# EAGLE design NodeGeneric.v1.cg2 (EAGLE 4.11)
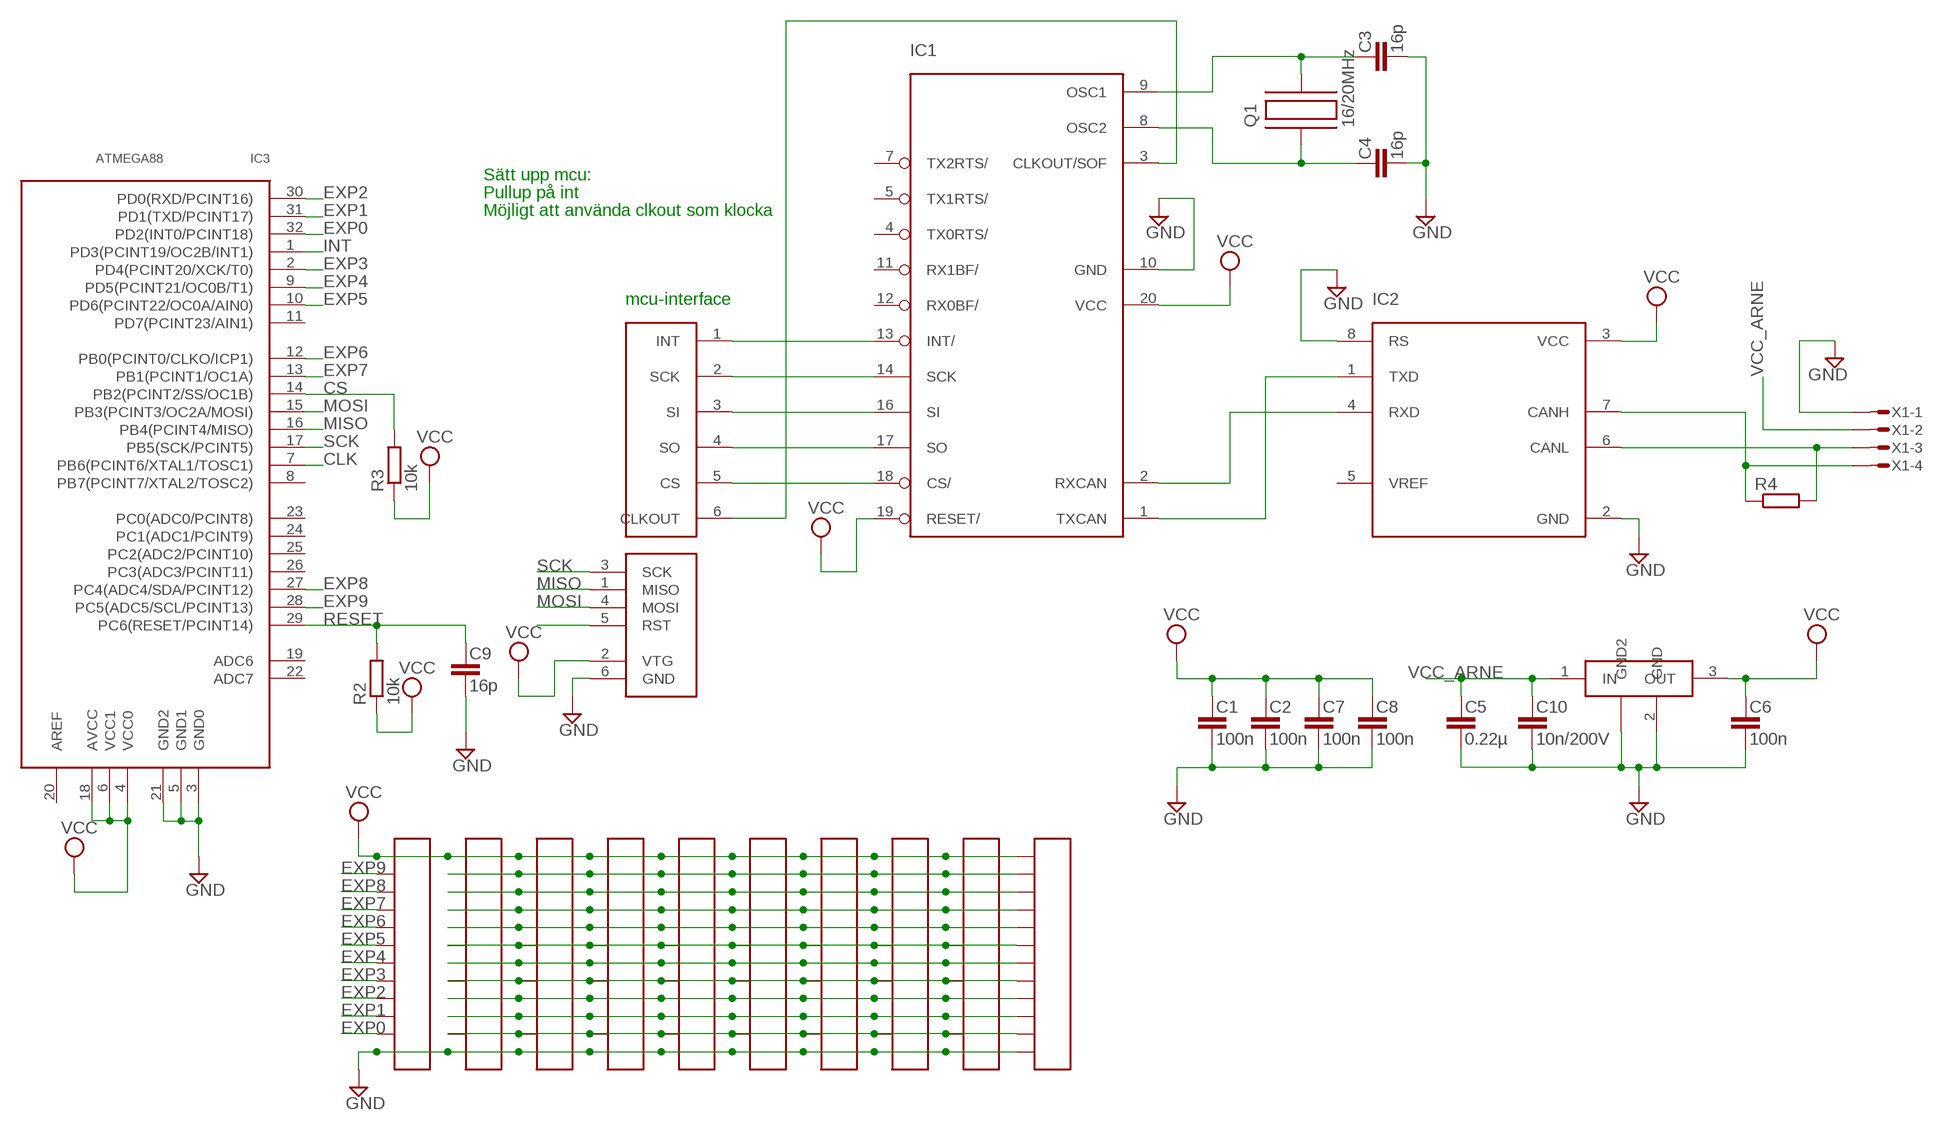
[diagram p0: schematic, sheet 1]

## Parts
C1  100n  C-EU  [C0603]
C2  100n  C-EU  [C0603]
C3  16p  C-EU  [C0603]
C4  16p  C-EU  [C0603]
C5  0.22µ  C-EU  [C0603]
C6  100n  C-EU  [C0603]
C7  100n  C-EU  [C0603]
C8  100n  C-EU  [C0603]
C9  16p  C-EU  [C0603]
C10  10n/200V  C-EU  [C0603]
IC1  MCP2515  [TSSOP]
IC2  MCP2551  [TSSOP]
IC3  ATMEGA88  [TQFP32]
IC4  LM340MP-5.0  [SOT223]
Q1  16/20MHz  C-MAC-LFA147E  [SMD]
R2  10k  R-EU_R0603  [R0603@1]
R3  10k  R-EUR0603  [R0603]
R4  R-EUR0603  [R0603]
U$1  CAN-INTERFACE  [VIA-LIST]
U$3  COLUMN  [COLUMN]
U$4  COLUMN  [COLUMN]
U$5  COLUMN  [COLUMN]
U$6  COLUMN  [COLUMN]
U$7  COLUMN  [COLUMN]
U$8  COLUMN  [COLUMN]
U$9  COLUMN  [COLUMN]
U$10  COLUMN  [COLUMN]
U$11  COLUMN  [COLUMN]
U$12  COLUMN  [COLUMN]
X1  MICROMATCH-4  [MICROMATCH-4-SMD]
X2  ISP  AVRISP6PIN  [6PIN]

## Nets
CANH: IC2.7(CANH) R4.1 X1.4
CLK: IC1.3(CLKOUT/SOF) IC3.7(PB6(PCINT6/XTAL1/TOSC1)) U$1.6(CLKOUT)
CS: IC1.18(CS/) IC3.14(PB2(PCINT2/SS/OC1B)) R3.2 U$1.5(CS)
EXP0: IC3.32(PD2(INT0/PCINT18)) U$3.11
EXP1: IC3.31(PD1(TXD/PCINT17)) U$3.10
EXP2: IC3.30(PD0(RXD/PCINT16)) U$3.9
EXP3: IC3.2(PD4(PCINT20/XCK/T0)) U$3.8
EXP4: IC3.9(PD5(PCINT21/OC0B/T1)) U$3.7
EXP5: IC3.10(PD6(PCINT22/OC0A/AIN0)) U$3.6
EXP6: IC3.12(PB0(PCINT0/CLKO/ICP1)) U$3.5
EXP7: IC3.13(PB1(PCINT1/OC1A)) U$3.4
EXP8: IC3.27(PC4(ADC4/SDA/PCINT12)) U$3.3
EXP9: IC3.28(PC5(ADC5/SCL/PCINT13)) U$3.2
EXP11: U$4.11 U$5.11 U$6.11 U$7.11 U$8.11 U$9.11 U$10.11 U$11.11 U$12.11
EXP12: U$4.10 U$5.10 U$6.10 U$7.10 U$8.10 U$9.10 U$10.10 U$11.10 U$12.10
EXP13: U$4.9 U$5.9 U$6.9 U$7.9 U$8.9 U$9.9 U$10.9 U$11.9 U$12.9
EXP14: U$4.8 U$5.8 U$6.8 U$7.8 U$8.8 U$9.8 U$10.8 U$11.8 U$12.8
EXP15: U$4.7 U$5.7 U$6.7 U$7.7 U$8.7 U$9.7 U$10.7 U$11.7 U$12.7
EXP16: U$4.6 U$5.6 U$6.6 U$7.6 U$8.6 U$9.6 U$10.6 U$11.6 U$12.6
EXP17: U$4.5 U$5.5 U$6.5 U$7.5 U$8.5 U$9.5 U$10.5 U$11.5 U$12.5
EXP18: U$4.4 U$5.4 U$6.4 U$7.4 U$8.4 U$9.4 U$10.4 U$11.4 U$12.4
EXP19: U$4.3 U$5.3 U$6.3 U$7.3 U$8.3 U$9.3 U$10.3 U$11.3 U$12.3
EXP20: U$4.2 U$5.2 U$6.2 U$7.2 U$8.2 U$9.2 U$10.2 U$11.2 U$12.2
GND: C1.2 C2.2 C3.2 C4.2 C5.2 C6.2 C7.2 C8.2 C9.2 C10.2 IC1.10(GND) IC2.2(GND) IC2.8(RS) IC3.3(GND0) IC3.5(GND1) IC3.21(GND2) IC4.2(GND) IC4.4(GND2) U$3.12 U$4.12 U$5.12 U$6.12 U$7.12 U$8.12 U$9.12 U$10.12 U$11.12 U$12.12 X1.1 X2.6(GND)
INT: IC1.13(INT/) IC3.1(PD3(PCINT19/OC2B/INT1)) U$1.1(INT)
MISO: IC1.17(SO) IC3.16(PB4(PCINT4/MISO)) U$1.4(SO) X2.1(MISO)
MOSI: IC1.16(SI) IC3.15(PB3(PCINT3/OC2A/MOSI)) U$1.3(SI) X2.4(MOSI)
N$1: IC1.2(RXCAN) IC2.4(RXD)
N$2: IC1.1(TXCAN) IC2.1(TXD)
N$5: IC2.6(CANL) R4.2 X1.3
N$12: C3.1 IC1.9(OSC1) Q1.P$2
N$13: C4.1 IC1.8(OSC2) Q1.P$1
RESET: C9.1 IC3.29(PC6(RESET/PCINT14)) R2.2 X2.5(RST)
SCK: IC1.14(SCK) IC3.17(PB5(SCK/PCINT5)) U$1.2(SCK) X2.3(SCK)
VCC: C1.1 C2.1 C6.1 C7.1 C8.1 IC1.19(RESET/) IC1.20(VCC) IC2.3(VCC) IC3.4(VCC0) IC3.6(VCC1) IC3.18(AVCC) IC4.3(OUT) R2.1 R3.1 U$3.1 U$4.1 U$5.1 U$6.1 U$7.1 U$8.1 U$9.1 U$10.1 U$11.1 U$12.1 X2.2(VTG)
VCC_ARNE: C5.1 C10.1 IC4.1(IN) X1.2
Unconnected: IC1.4(TX0RTS/) IC1.5(TX1RTS/) IC1.7(TX2RTS/) IC1.11(RX1BF/) IC1.12(RX0BF/) IC2.5(VREF) IC3.8(PB7(PCINT7/XTAL2/TOSC2)) IC3.11(PD7(PCINT23/AIN1)) IC3.19(ADC6) IC3.20(AREF) IC3.22(ADC7) IC3.23(PC0(ADC0/PCINT8)) IC3.24(PC1(ADC1/PCINT9)) IC3.25(PC2(ADC2/PCINT10)) IC3.26(PC3(ADC3/PCINT11))

## Notes on the sheet
- Sätt upp mcu:
- Pullup på int
- Möjligt att använda clkout som klocka
- mcu-interface

## Library data of the parts
C1-C10 = rcl:C-EU
IC1 = mcp2515:MCP2515
IC2 = mcp2551:MCP2551
IC3 = atmega88:ATMEGA88
IC4 = lm340mp:LM340MP-5.0
Q1 = hc49-4h-smx:C-MAC-LFA147E
R2 = rcl:R-EU_: RESISTOR, European symbol
R3 R4 = rcl:R-EU
U$1 = can-interface:CAN-INTERFACE
U$3-U$12 = expboard:COLUMN
X1 = micromatch-smd:MICROMATCH-4: MicroMaTch 4 7-215464-4 / 0-215464-4 Drawing Number C-215464 DDEController.pdf
X2 = avrisp:AVRISP6PIN

## Board
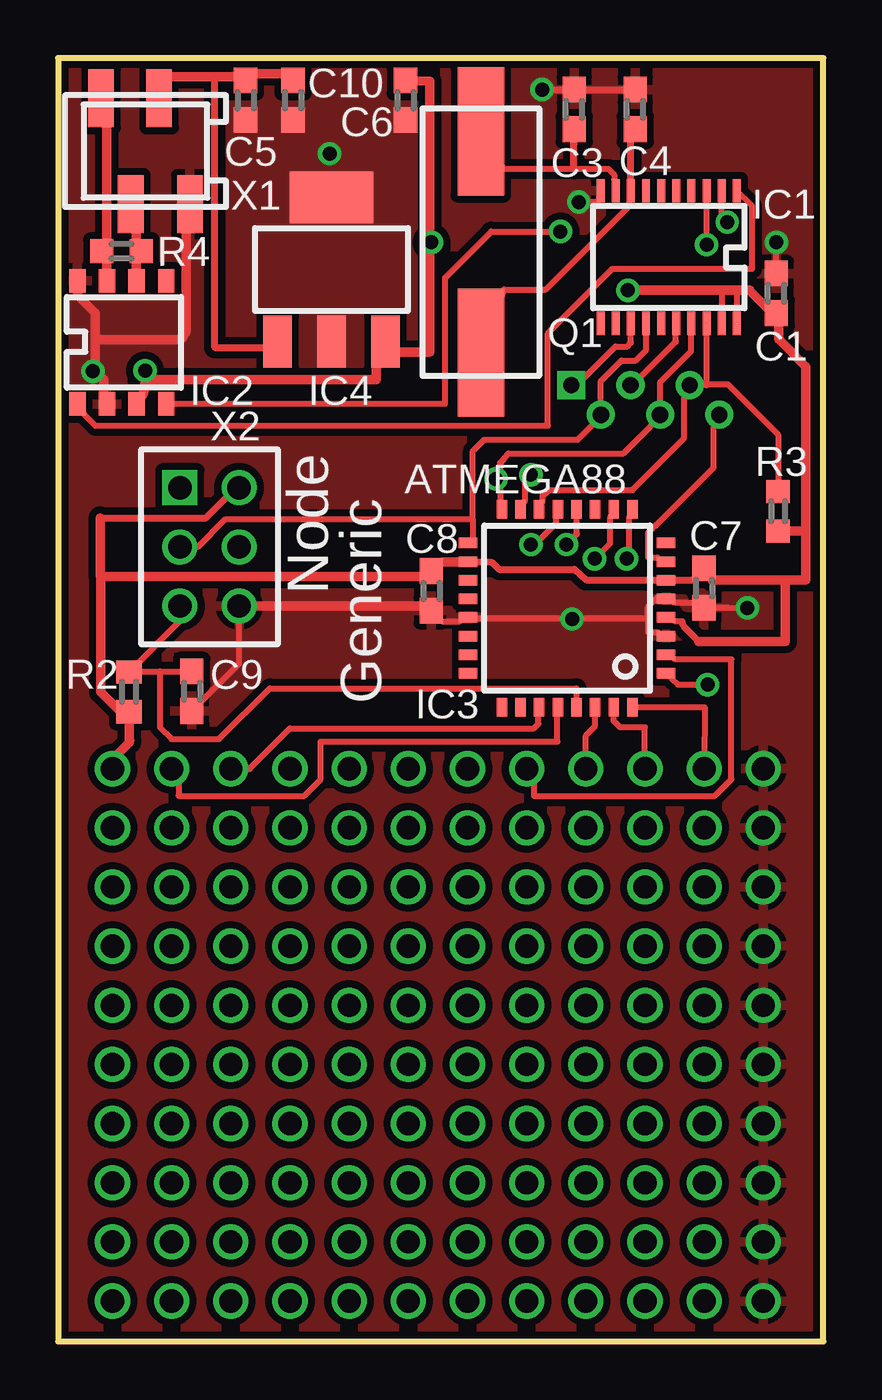
[diagram p1: board, top side]
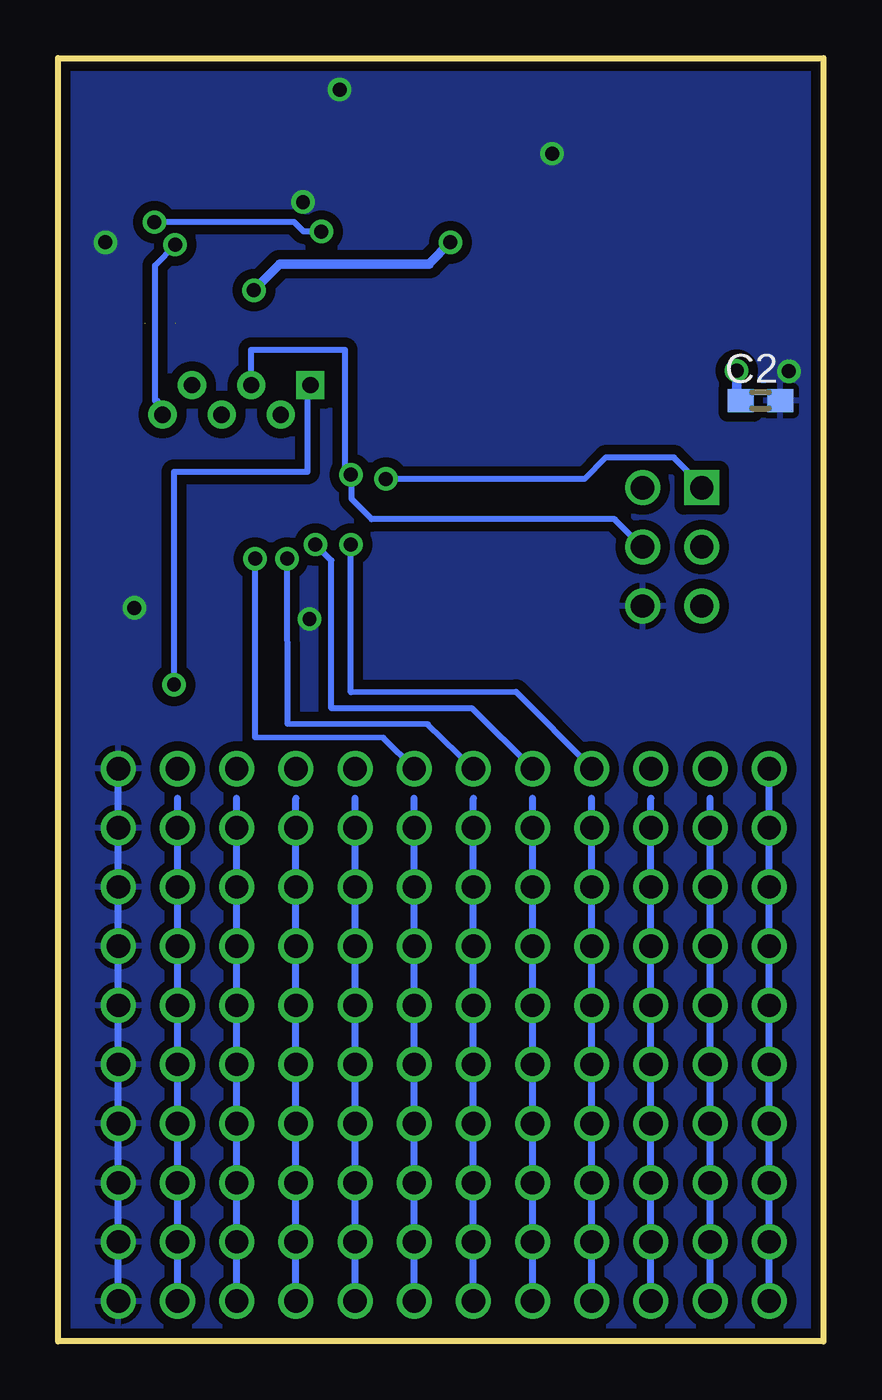
[diagram p2: board, bottom side, seen from below]

Size 32.85 x 55.1 mm. Coordinates in mm from the lower left corner, seen from the top.
Outline: 0,0 32.85,0 32.85,55.1 0,55.1 0,0
Copper layers (1*16): Top 0.035mm / dielectric 1.5mm / Bottom 0.035mm
Design rules "10mils, 0.6drill": minimum track width 10mil, minimum drill 0.6mm, track to track 10mil, track to pad 10mil, pad to pad 10mil, via to via 10mil, smd to smd 10mil, copper to edge 10mil, drill to drill 10mil, minimum pad ring 10mil, minimum via ring 8mil, stop-mask expansion 0mil, vias tented up to drill 0mil, thermal gap 10mil

### Footprints (pad centres in the part's own frame; a part is rotated, then mirrored left to right if it is on the bottom)
C0603 = smd 1.1 x 1: 1 -0.85,0; 2 0.85,0
TSSOP = smd 0.34 x 1: 1 -2.925,-2.85; 2 -2.275,-2.85; 3 -1.625,-2.85; 4 -0.975,-2.85; 5 -0.325,-2.85; 6 0.325,-2.85; 7 0.975,-2.85; 8 1.625,-2.85; 9 2.275,-2.85; 10 2.925,-2.85; 11 2.925,2.85; 12 2.275,2.85; 13 1.625,2.85; 14 0.975,2.85; 15 0.325,2.85; 16 -0.325,2.85; 17 -0.975,2.85; 18 -1.625,2.85; 19 -2.275,2.85; 20 -2.925,2.85
TSSOP' = smd 0.7 x 1: 1 -1.981,-2.645; 2 -0.711,-2.645; 3 0.559,-2.645; 4 1.829,-2.645; 5 1.829,2.645; 6 0.559,2.645; 7 -0.711,2.645; 8 -1.981,2.645
TQFP32 = smd 0.8 x 0.45: 1 -4.25,2.65; 2 -4.25,1.85; 3 -4.25,1.05; 4 -4.25,0.25; 5 -4.25,-0.55; 6 -4.25,-1.35; 7 -4.25,-2.15; 8 -4.25,-2.95; 17 4.25,-2.95; 18 4.25,-2.15; 19 4.25,-1.35; 20 4.25,-0.55; 21 4.25,0.25; 22 4.25,1.05; 23 4.25,1.85; 24 4.25,2.65 | smd 0.45 x 0.8: 9 -2.8,-4.4; 10 -2,-4.4; 11 -1.2,-4.4; 12 -0.4,-4.4; 13 0.4,-4.4; 14 1.2,-4.4; 15 2,-4.4; 16 2.8,-4.4; 25 2.8,4.1; 26 2,4.1; 27 1.2,4.1; 28 0.4,4.1; 29 -0.4,4.1; 30 -1.2,4.1; 31 -2,4.1; 32 -2.8,4.1
SOT223 = smd 1.219 x 2.235: 1 -2.311,-3.099; 2 0,-3.099; 3 2.311,-3.099 | smd 3.6 x 2.2: 4 0,3.099
SMD = smd 5.5 x 2: P$1 4.75,0; P$2 -4.75,0
R0603@1 = smd 1 x 1.1: 1 -0.85,0; 2 0.85,0
R0603 = smd 0.991 x 1.016: 1 -0.85,0; 2 0.85,0
VIA-LIST = drill 0.7 square: 1 0,2.54 | drill 0.7 round: 2 -1.27,1.27; 3 0,0; 4 -1.27,-1.27; 5 0,-2.54; 6 -1.27,-3.81
COLUMN = drill 1 round: 1 0,15.24; 2 0,12.7; 3 0,10.16; 4 0,7.62; 5 0,5.08; 6 0,2.54; 7 0,0; 8 0,-2.54; 9 0,-5.08; 10 0,-7.62; 11 0,-10.16; 12 0,-12.7
MICROMATCH-4-SMD = smd 1.1 x 2.5: 1 1.905,-2.272; 2 0.585,2.272; 3 -0.635,-2.272; 4 -1.905,2.272
6PIN = drill 1 square: 1 -1.27,2.54 | drill 1 round: 2 1.27,2.54; 3 -1.27,0; 4 1.27,0; 5 -1.27,-2.54; 6 1.27,-2.54

### Placement (x,y rotation side)
C1  30.82,45 90 top
C2  2.7,40.4 0 bottom
C3  22.15,52.9 90 top
C4  24.77,52.9 90 top
C5  8.04,53.29 270 top
C6  14.9,53.29 270 top
C7  27.72,32.35 270 top
C8  16.02,32.22 270 top
C9  5.73,27.92 270 top
C10  10.07,53.29 270 top
IC1  26.21,46.56 180 top
IC2  MCP2551  [TSSOP']  2.8,42.9 0 top
IC3  21.85,31.33 180 top
IC4  11.73,46.02 0 top
Q1  18.14,47.2 270 top
R2  3.04,27.89 90 top
R3  30.9,35.64 90 top
R4  2.71,46.81 0 top
U$1  24.57,41.06 90 top
U$3  17.57,24.59 90 top
U$4  17.57,1.73 90 top
U$5  17.57,4.27 90 top
U$6  17.57,6.81 90 top
U$7  17.57,9.35 90 top
U$8  17.57,11.89 90 top
U$9  17.57,14.43 90 top
U$10  17.57,16.97 90 top
U$11  17.57,19.51 90 top
U$12  17.57,22.05 90 top
X1  3.75,51.1 0 top
X2  6.49,34.11 0 top

### Tracks (layer width: path | path; a pad name or v marks a point on that pad's centre or on a via)
CANH
  Top 0.254: R4.1 2.07,46.81 2.07,46.69 2.07,45.54 IC2.7
  Top 0.406: X1.4 2.07,52.76 2.07,46.69 2.07,45.56 IC2.7
CLK  (via drill 0.6)
  Top 0.254: v27.83,47.09 27.83,48.92 IC1.3 | U$1.6 28.13,39.22 28.13,37.52 25.67,35.05 25.67,35.03 25.57,35 25.49,34.93 25.52,34.93 25.31,34.72 25.31,33.66 25.72,33.66 25.9,33.48 IC3.7
  Bottom 0.254: v27.83,47.09 28.69,46.2 28.69,40.39 28.59,40.39 U$1.6
CS  (1 unrouted)
  Top 0.254: 27.83,41.1 27.83,41.06 | 27.83,41.1 IC1.18 | 24.7,36.63 24.65,36.58 | 24.7,36.63 26.86,38.79 26.86,40.74 27.11,40.98 U$1.5 27.09,41.06 27.09,41.1 27.83,41.1 | IC3.14 20.79,36.09 20.79,36.3 21.05,36.55 24.65,36.55 24.7,36.63 | R3.2 30.9,38.94 28.74,41.1 27.83,41.1
EXP0
  Top 0.254: U$3.11 27.73,24.72 27.75,27.23 IC3.32
EXP1
  Top 0.254: IC3.31 23.85,26.64 24.12,26.37 25.19,26.37 U$3.10
EXP2
  Top 0.254: IC3.30 23.05,26.43 22.65,26.01 U$3.9
EXP3
  Top 0.254: IC3.2 26.48,29.29 28.9,29.29 28.9,24.13 28.18,23.42 20.41,23.42 20.41,23.88 U$3.8
EXP4  (via drill 0.6)
  Top 0.254: v24.4,33.61 24.5,33.71 24.5,35.33 IC3.9
  Bottom 0.254: v24.4,33.61 24.4,25.93 18.89,25.91 U$3.7
EXP5  (via drill 0.6)
  Top 0.254: v23.03,33.61 23.69,34.27 23.69,35.33 IC3.10
  Bottom 0.254: v23.03,33.61 23,26.52 16.98,26.49 U$3.6
EXP6  (via drill 0.6)
  Top 0.254: IC3.12 22.27,35.71 22.27,34.67 v21.81,34.22
  Bottom 0.254: v21.81,34.22 21.12,33.53 21.12,27.18 15.08,27.18 U$3.5
EXP7  (via drill 0.6)
  Top 0.254: v20.29,34.22 20.46,34.22 21.38,35.13 21.38,35.64 21.45,35.7 IC3.13
  Bottom 0.254: v20.29,34.22 20.29,27.87 13.2,27.89 9.97,24.64 9.9,24.61 U$3.4
EXP8
  Top 0.254: 8.22,24.59 9.95,26.32 20.41,26.32 20.62,26.52 20.62,27.08 20.67,27.13 20.65,27.15 IC3.27
  Top 0.305: U$3.3 8.22,24.59
EXP9
  Top 0.254: U$3.2 5.17,23.88 5.17,23.42 10.56,23.42 11.27,24.13 11.27,25.76 21.43,25.76 21.43,27.23 IC3.28
EXP11
  Bottom 0.305: U$4.11 U$5.11 U$6.11 U$7.11 U$8.11 U$9.11 U$10.11 U$11.11 U$12.11 27.73,23.32
EXP12
  Bottom 0.305: U$4.10 U$5.10 U$6.10 U$7.10 U$8.10 U$9.10 U$10.10 U$11.10 U$12.10 25.19,23.32
EXP13
  Bottom 0.305: U$4.9 U$5.9 U$6.9 U$7.9 U$8.9 U$9.9 U$10.9 U$11.9 U$12.9 22.65,23.32
EXP14
  Bottom 0.305: U$4.8 U$5.8 U$6.8 U$7.8 U$8.8 U$9.8 U$10.8 U$11.8 U$12.8 20.11,23.32
EXP15
  Bottom 0.305: U$4.7 U$5.7 U$6.7 U$7.7 U$8.7 U$9.7 U$10.7 U$11.7 U$12.7 17.57,23.32
EXP16
  Bottom 0.305: U$4.6 U$5.6 U$6.6 U$7.6 U$8.6 U$9.6 U$10.6 U$11.6 U$12.6 15.03,23.32
EXP17
  Bottom 0.305: U$4.5 U$5.5 U$6.5 U$7.5 U$8.5 U$9.5 U$10.5 U$11.5 U$12.5 12.49,23.32
EXP18
  Bottom 0.305: U$4.4 U$5.4 U$6.4 U$7.4 U$8.4 U$9.4 U$10.4 U$11.4 U$12.4 9.95,23.32
EXP19
  Bottom 0.305: U$4.3 U$5.3 U$6.3 U$7.3 U$8.3 U$9.3 U$10.3 U$11.3 U$12.3 7.41,23.32
EXP20
  Bottom 0.305: U$4.2 U$5.2 U$6.2 U$7.2 U$8.2 U$9.2 U$10.2 U$11.2 U$12.2 4.87,23.32
GND  (via drill 0.6)
  Top 0.254: v22.34,48.92 23.16,48.92 IC1.10 | v30.83,47.19 30.83,46.33 C1.2 | 1.59,41.66 v1.49,41.66 | C8.2 16.48,30.91 17.24,30.91 IC3.21 17.95,31.07 21.91,31.07 | 25.31,31.07 25.31,31.52 25.72,31.93 IC3.5 26.48,31.73 27.25,31.73 C7.2 28.76,31.5 v29.58,31.5 | 25.31,31.07 25.31,30.45 25.72,30.45 IC3.3 | 21.91,31.07 25.31,31.07 | 21.91,31.07 v22.06,31.01 | C9.2 7.76,29.1 X2.6
  Top 0.305: IC2.2 1.95,40.69 | C4.2 C3.2 v20.77,53.75
  Top 0.406: 1.95,40.69 1.95,41.3 1.59,41.66 1.59,43 | 1.59,43 1.59,44.15 0.83,44.91 IC2.8 | C8.2 16.02,31.55 16.04,31.57 X2.6 | X1.1 5.5,47.71 5.5,43.38 5.25,43 1.59,43
  Bottom 0.254: v29.58,31.5 29.61,31.5
  Bottom 0.305: v20.77,53.75 20.59,53.7 | U$4.12 U$5.12 U$6.12 U$7.12 U$8.12 U$9.12 U$10.12 U$11.12 U$12.12 U$3.12
  other vias: 11.65,51
  pour Bottom (isolate 0.406): -0.01,55.12 32.83,55.12 32.83,-0.03 24.38,-0.03 -0.01,-0.03
  pour Top (isolate 0.305, no thermals): 6.83,54.5 15.89,54.5 15.89,41.44 6.83,41.44
  pour Top (isolate 0.305): -0.08,55.32 33.06,55.32 33.06,-0.18 -0.08,-0.18
INT  (via drill 0.6)
  Top 0.254: v27.88,28.2 26.61,28.2 IC3.1 | IC1.13 24.58,43.59 24.58,42.88 24.43,42.72 23.92,42.72 22.25,41.06 U$1.1 22.01,41.07 22.01,41.1
  Bottom 0.254: v27.88,28.2 27.88,37.34 22.14,37.34 22.14,40.97 22.01,40.97 | 22.01,40.97 22.02,40.98 | 22.01,41.07 22.01,41.1 | 22.01,41.07 U$1.1 | 22.01,40.97 22.01,41.07
MISO  (via drill 0.6)
  Top 0.254: 18.96,36.98 18.96,36.04 IC3.16 | 18.96,36.98 18.96,37.72 19.32,38.13 24.25,38.13 25.84,39.71 25.82,39.73 25.82,39.8 | v18.79,37.03 18.84,36.98 18.96,36.98 | IC1.17 27.18,43.65 27.17,43.64 27.17,42.52 25.84,41.19 U$1.4 25.82,39.8 | 25.82,39.8 25.82,39.83
  Bottom 0.254: v18.79,37.03 10.25,37.03 9.34,37.95 6.42,37.95 5.12,36.65 X2.1
MOSI  (via drill 0.6)
  Top 0.254: v20.29,37.21 20.03,36.93 20.03,36.09 IC3.15 | U$1.3 24.64,41.06 26.51,42.93 26.51,43.69 IC1.16
  Bottom 0.254: X2.4 7.79,34.11 8.96,35.28 8.96,35.31 19.4,35.31 20.26,36.17 20.26,37.19 v20.29,37.21 20.54,37.21 20.54,42.57 24.58,42.57 24.58,41.12 24.55,41.1 24.56,41.09 U$1.3
N$1  (via drill 0.6)
  Top 0.254: v21.56,47.65 18.58,47.65 16.6,45.67 16.6,40.26 4.94,40.26 IC2.4 | v28.72,48.06 28.49,48.29 IC1.2
  Bottom 0.254: v21.56,47.65 22.32,47.65 22.72,48.06 v28.72,48.06
N$2
  Top 0.254: IC2.1 1.13,39.78 1.59,39.32 21.02,39.32 21.02,43.28 23.79,46.05 29.79,46.05 29.79,48.76 IC1.1
N$5
  Top 0.254: R4.2 3.34,46.81 3.34,46.69 3.34,45.54 IC2.6
  Top 0.406: IC2.6 3.34,45.56 3.34,46.69 3.34,47.84 X1.3
N$12
  Top 0.254: IC1.9 23.87,49.89 23.87,50.09 23.61,50.34 22.14,50.34 19.14,50.34 Q1.P$2
  Top 0.305: C3.1 22.14,51.42 22.14,50.34
N$13
  Top 0.254: IC1.8 24.53,48.92 24.53,48.77 20.92,45.16 19.14,45.16 Q1.P$1
  Top 0.305: IC1.8 24.58,51.86 C4.1
RESET
  Top 0.254: C9.1 5.72,28.75 4.36,28.75 | 4.36,28.75 3.05,28.75 R2.2 5.22,30.92 5.22,31.42 5.25,31.45 5.22,31.47 X2.5 | IC3.29 22.19,27.28 22.24,27.33 22.24,28.04 9.08,28.04 6.9,25.86 4.87,25.86 4.36,26.37 4.36,28.75 | 4.36,28.75 4.36,28.78
SCK
  Top 0.254: 17.8,35.31 17.8,34.47 IC3.17 | 17.8,35.31 17.8,38.23 18.28,38.71 22.29,38.71 23.29,39.71 23.28,39.73 23.28,39.8 | 17.8,35.31 7.18,35.31 5.99,34.11 5.63,34.14 5.27,34.14 5.25,34.11 X2.3 | IC1.14 25.23,43.68 25.19,43.64 25.24,43.59 25.24,42.57 24.78,42.11 24.17,42.11 23.29,41.24 U$1.2 23.28,39.8 | 23.28,39.8 23.28,39.83
VCC  (via drill 0.6)  (1 unrouted)
  Top 0.254: 29.15,43.69 IC1.20 29.13,45.03 29.12,45.04 29.12,45.14 | 3.78,41.3 3.73,41.23 | C8.1 16.48,33.45 | 26.89,30.66 26.89,30.71 26.84,30.71 26.84,30.76 26.79,30.76 26.79,30.91 26.48,30.91 IC3.4 | 26.48,32.69 IC3.6 25.72,32.69 | 3.04,25.71 3.14,25.81 | U$3.1 2.33,24.84 | 2.33,24.84 2.33,24.99 | 7.46,36.48 7.59,36.48 | 2.33,24.84 2.28,24.84 | 28.48,43.65 28.49,43.64 | 28.48,43.65 IC1.19 | 28.49,45.14 28.49,45.04 28.48,45.03 28.48,43.65
  Top 0.305: IC4.3 13.66,42.06 | 17.24,33.45 IC3.18 18.61,33.45 18.94,33.15 22.16,33.15 22.67,32.69 25.72,32.69 | 27.5,30.05 26.89,30.66 | 26.48,32.69 27.25,32.69 C7.1 | C8.1 15.69,32.97 15.69,32.84 | 7.59,36.48 X2.2 | 7.46,36.48 6.34,35.36 1.79,35.36 | 3.04,26.75 2.96,26.75
  Top 0.406: C6.1 15.95,54.11 15.95,47.19 | 15.95,47.19 15.95,42.48 14.08,42.48 14.08,43.18 IC4.3 | 3.78,41.3 13.66,41.3 13.66,42.06 | IC2.3 3.67,40.74 3.73,41.23 v3.73,41.68 | v16.02,47.19 15.95,47.19 | v24.45,45.14 28.49,45.14 29.12,45.14 29.68,45.14 29.68,45.11 30.65,44.15 C1.1 30.9,44.15 30.93,44.12 30.93,43.03 32.1,41.86 32.1,34.75 | 16.48,33.45 17.24,33.45 | 27.5,30.05 31.21,30.05 31.21,32.69 | 31.21,32.69 28.08,32.69 C7.1 | 2.33,24.99 3.04,25.71 3.04,26.75 R2.1 | 32.1,34.75 32.1,32.69 31.21,32.69 | 1.82,32.84 15.69,32.84 | 1.82,32.84 1.82,27.89 2.96,26.75 | 1.79,35.36 1.79,32.87 1.82,32.84 | 32.1,34.75 32.05,34.75 32.05,34.79 R3.1
  Bottom 0.254: 3.73,40.9 C2.1
  Bottom 0.305: 16.93,46.25 16.93,46.28 | U$4.1 U$5.1 U$6.1 U$7.1 U$8.1 U$9.1 U$10.1 U$11.1 U$12.1 U$3.1
  Bottom 0.406: v3.73,41.68 3.73,40.9 | 16.93,46.28 v16.02,47.19 | 16.93,46.25 23.33,46.25 v24.45,45.14
VCC_ARNE
  Top 0.305: 6.72,54.36 8.09,54.36 8.07,54.17 C5.1 | 6.72,54.36 7.48,54.31 | 6.72,54.36 6.72,42.67 9.31,42.67 9.31,42.92 IC4.1
  Top 0.406: C10.1 10.07,54.43 8.17,54.43 8.17,54.17 | 8.17,54.17 8.04,54.18 | 8.07,54.17 8.17,54.17 | X1.2 4.37,54.31 7.48,54.31

### Text on the board
tNames: Node | Generic
tDocu: 9 | 8 | 7 | 6 | 5 | 4 | 3 | 0 | 1 | 2 | VCC | GND